# Altium schematic sheet MSP430F5528ZQFE.SchDoc
size A4
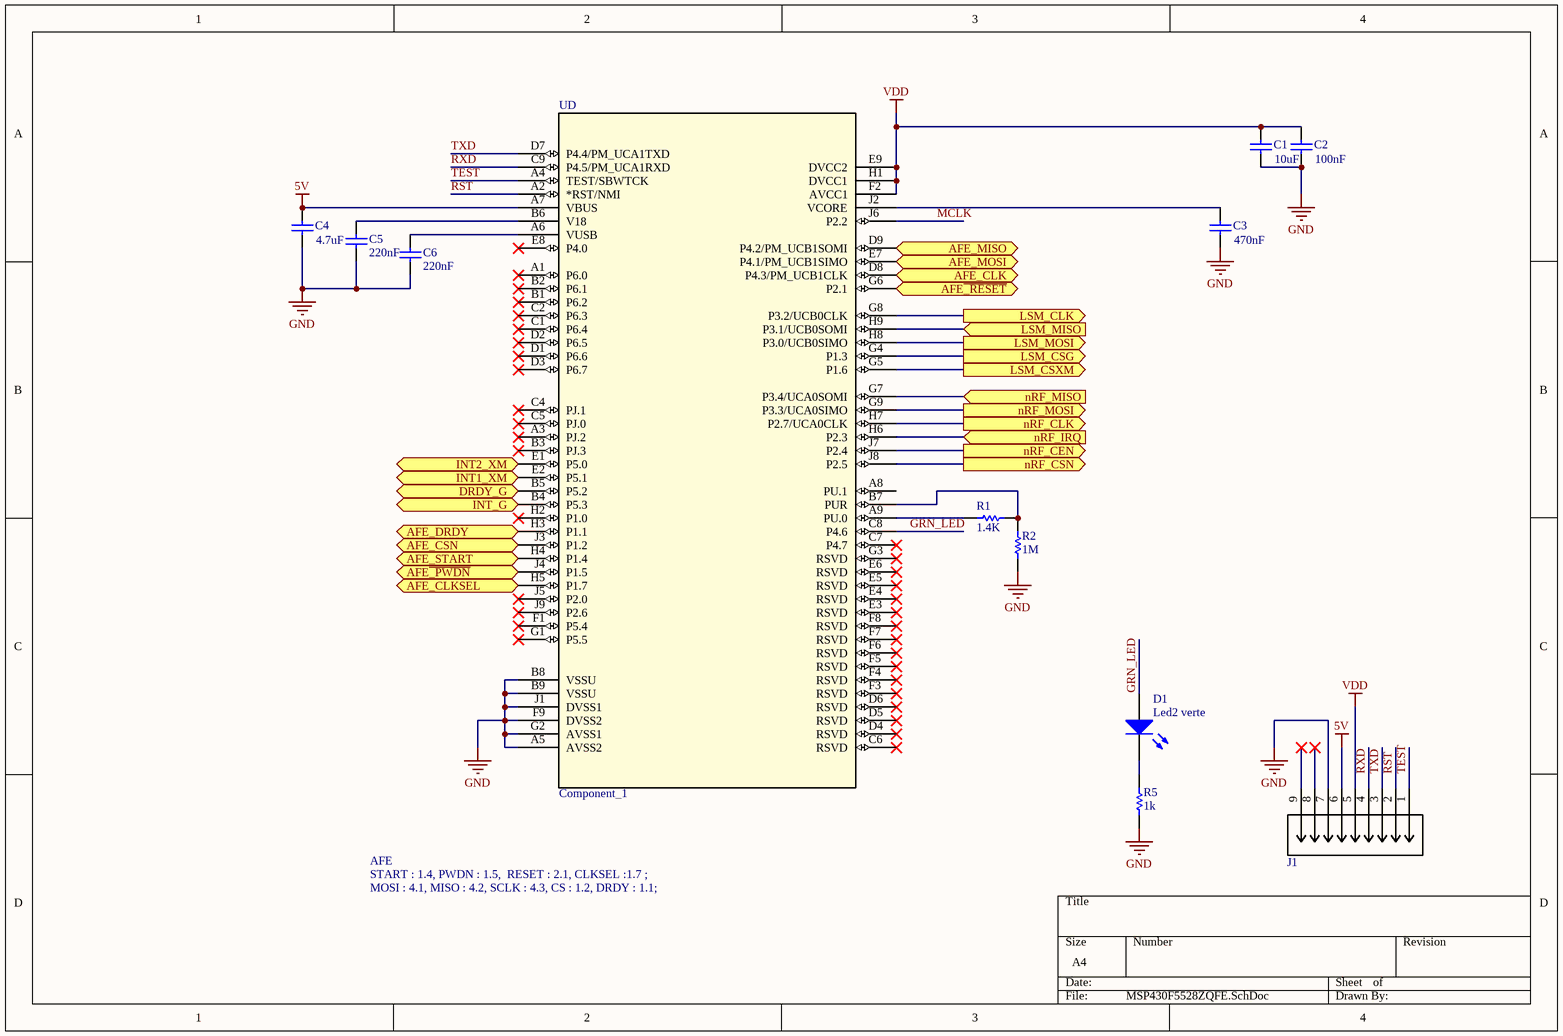
[diagram p0: MSP430F5528ZQFE.SchDoc]

## Parts
C1  value 10uF  [0402]  (hidden comment: Cap Semi)
C2  value 100nF  [0402]  (hidden comment: Cap Semi)
C3  value 470nF  [0402]  (hidden comment: Cap Semi)
C4  value 4.7uF  [0402]  (hidden comment: Cap Semi)
C5  value 220nF  [0402]  (hidden comment: Cap Semi)
C6  value 220nF  [0402]  (hidden comment: Cap Semi)
D1  Led2 verte  [0805 (2012 metric)]
J1  FH12-7S-1SH(55)  [CON7_1X7_DRBF_HS]  (value not drawn)
R1  value 1.4K  [0402]
R2  value 1M  [0402]
R5  value 1k  [0402]
UD  Component_1  [MSP430F5528ZQFE]

## Ports
AFE_CLK (out), AFE_CLKSEL (out), AFE_CSN (out), AFE_DRDY (in), AFE_MISO (in), AFE_MOSI (out), AFE_START (out), AFE~{_PWDN} (out), AFE~{_RESET} (out), DRDY_G (in), INT1_XM (in), INT2_XM (in), INT_G (in), LSM_CLK (out), LSM_CSG (out), LSM_CSXM (out), LSM_MISO (in), LSM_MOSI (out), nRF_CEN (out), nRF_CLK (out), nRF_CSN (out), nRF_IRQ (in), nRF_MISO (in), nRF_MOSI (out)

## Nets
5V: C4.1 J1.6 UD.A7(VBUS)
GND: C1.2 C2.2 C3.2 C4.2 C5.1 C6.1 J1.7 R2.2 R5.2 UD.A5(AVSS2) UD.B8(VSSU) UD.B9(VSSU) UD.F9(DVSS2) UD.G2(AVSS1) UD.J1(DVSS1)
VDD: C1.1 C2.1 J1.5 UD.E9(DVCC2) UD.F2(AVCC1) UD.H1(DVCC1)
AFE~{_PWDN}: UD.J4(P1.5) ; port AFE~{_PWDN}
AFE~{_RESET}: UD.G6(P2.1) ; port AFE~{_RESET}
AFE_CLK: UD.D8(P4.3/PM_UCB1CLK) ; port AFE_CLK
AFE_CLKSEL: UD.H5(P1.7) ; port AFE_CLKSEL
AFE_CSN: UD.J3(P1.2) ; port AFE_CSN
AFE_DRDY: UD.H3(P1.1) ; port AFE_DRDY
AFE_MISO: UD.D9(P4.2/PM_UCB1SOMI) ; port AFE_MISO
AFE_MOSI: UD.E7(P4.1/PM_UCB1SIMO) ; port AFE_MOSI
AFE_START: UD.H4(P1.4) ; port AFE_START
DRDY_G: UD.B5(P5.2) ; port DRDY_G
GRN_LED: D1.1(A) UD.C8(P4.6)
INT1_XM: UD.E2(P5.1) ; port INT1_XM
INT2_XM: UD.E1(P5.0) ; port INT2_XM
INT_G: UD.B4(P5.3) ; port INT_G
LSM_CLK: UD.G8(P3.2/UCB0CLK) ; port LSM_CLK
LSM_CSG: UD.G4(P1.3) ; port LSM_CSG
LSM_CSXM: UD.G5(P1.6) ; port LSM_CSXM
LSM_MISO: UD.H9(P3.1/UCB0SOMI) ; port LSM_MISO
LSM_MOSI: UD.H8(P3.0/UCB0SIMO) ; port LSM_MOSI
MCLK: UD.J6(P2.2)
nRF_CEN: UD.J7(P2.4) ; port nRF_CEN
nRF_CLK: UD.H7(P2.7/UCA0CLK) ; port nRF_CLK
nRF_CSN: UD.J8(P2.5) ; port nRF_CSN
nRF_IRQ: UD.H6(P2.3) ; port nRF_IRQ
nRF_MISO: UD.G7(P3.4/UCA0SOMI) ; port nRF_MISO
nRF_MOSI: UD.G9(P3.3/UCA0SIMO) ; port nRF_MOSI
RST: J1.2 UD.A2(*RST/NMI)
RXD: J1.4 UD.C9(P4.5/PM_UCA1RXD)
TEST: J1.1 UD.A4(TEST/SBWTCK)
TXD: J1.3 UD.D7(P4.4/PM_UCA1TXD)
NetC3_1: C3.1 UD.J2(VCORE)
NetC5_2: C5.2 UD.B6(V18)
NetC6_2: C6.2 UD.A6(VUSB)
NetD1_2: D1.2(K) R5.1
NetR1_1: R1.1 R2.1 UD.B7(PUR)
NetR1_2: R1.2 UD.A9(PU.0)

Not connected (* = marked no-connect by the designer): J1 8* 9*; UD A1(P6.0)* A3(PJ.2)* A8(PU.1) B1(P6.2)* B2(P6.1)* B3(PJ.3)* C1(P6.4)* C2(P6.3)* C4(PJ.1)* C5(PJ.0)* C6(RSVD)* C7(P4.7)* D1(P6.6)* D2(P6.5)* D3(P6.7)* D4(RSVD)* D5(RSVD)* D6(RSVD)* E3(RSVD)* E4(RSVD)* E5(RSVD)* E6(RSVD)* E8(P4.0)* F1(P5.4)* F3(RSVD)* F4(RSVD)* F5(RSVD)* F6(RSVD)* F7(RSVD)* F8(RSVD)* G1(P5.5)* G3(RSVD)* H2(P1.0)* J5(P2.0)* J9(P2.6)*

## Notes on the sheet
- AFE
- START : 1.4, PWDN : 1.5,  RESET : 2.1, CLKSEL :1.7 ;
- MOSI : 4.1, MISO : 4.2, SCLK : 4.3, CS : 1.2, DRDY : 1.1;

## Library data of the parts
C1-C6 = Cap Semi: Capacitor (Semiconductor SIM Model); Published: 8-Jun-2000; LatestRevisionDate: 29-May-2009; LatestRevisionNote: IPC-7351 Footprint Added.; PackageReference: C1206; Publisher: Altium Limited; PackageDescription: Chip Capacitor; Supplier 1: Digi-Key
  C1 C2: Supplier Part Number 1: 490-10692-2-ND
  C3: Supplier Part Number 1: 1276-1734-2-ND
  C4: Supplier Part Number 1: 490-5915-2-ND
  C5 C6: Supplier Part Number 1: 490-3884-2-ND
D1 = LED3: LED 2X1.2MM 570NM GN WTR CLR SMD; Supplier 1: Digi-Key; Supplier Part Number 1: 754-1651-1-ND
J1 = FH12-7S-1SH(55): Imported; Voltage_Rating: 50V; Current_Rating: 0.500A; Operating_Temperature: -40Â°C ~ 85Â°C; Contact_Finish: Gold; Cable_End_Type: Straight; Vendor: Hirose; Pitch: 0.039" (1.00mm); Mounting_Type: Surface Mount, Right Angle; Connector_Type: Bottom Contacts; Number_of_Positions: 7; Locking_Feature: Flip Lock; FFC,_FCB_Thickness: 0.30mm; Height_Above_Board: 0.079" (2.00mm); Copyright: Copyright (C) 2015 Accelerated Designs. All rights reserved; Housing_Material: Polyamide (PA), Nylon; Contact_Finish_Thickness: -; Manufacturer_Part_Number: FH12-7S-1SH(55); DigiKeyPartNumber: HFB107TR-ND; Quantity_Available: 10000; Category: Connectors; DataSheet: http://www.hirose.co.jp/cataloge_hp/e58605370.pdf; Features: Zero Insertion Force (ZIF); Packaging: Tape &amp; Reel (TR); Series: FH12; Termination: Solder; RefDes: RefDes; Type: Type; Value: Value
R1 R2 R5 = Res Semi: Semiconductor Resistor; Published: 8-Jun-2000; LatestRevisionDate: 17-Jul-2002; LatestRevisionNote: Re-released for DXP Platform.; PackageReference: AXIAL-0.5; Publisher: Altium Limited; PackageDescription: Axial Device, Thru-Hole; 2 Leads; 0.5 in Pin Spacing; Supplier 1: Digi-Key
  R1: Supplier Part Number 1: RHM1.4KBHTR-ND
  R2: Supplier Part Number 1: RHM1.00MCDTR-ND
  R5: Supplier Part Number 1: RHM100CDTR-ND